# EAGLE design tssop14 (EAGLE 9.2.2)
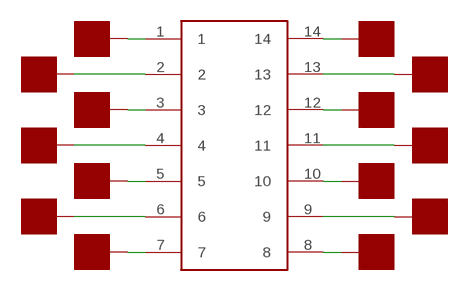
[diagram p0: schematic, sheet 1]

## Parts
IC1  TSSOP14  [TSSOP14]
U$1  PAD50MIL  [PAD_50MIL]
U$2  PAD50MIL  [PAD_50MIL]
U$3  PAD50MIL  [PAD_50MIL]
U$4  PAD50MIL  [PAD_50MIL]
U$5  PAD50MIL  [PAD_50MIL]
U$6  PAD50MIL  [PAD_50MIL]
U$7  PAD50MIL  [PAD_50MIL]
U$8  PAD50MIL  [PAD_50MIL]
U$9  PAD50MIL  [PAD_50MIL]
U$10  PAD50MIL  [PAD_50MIL]
U$11  PAD50MIL  [PAD_50MIL]
U$12  PAD50MIL  [PAD_50MIL]
U$13  PAD50MIL  [PAD_50MIL]
U$14  PAD50MIL  [PAD_50MIL]

## Nets
N$1: IC1.1 U$8.P$1
N$2: IC1.2 U$9.P$1
N$3: IC1.3 U$10.P$1
N$4: IC1.4 U$11.P$1
N$5: IC1.5 U$12.P$1
N$6: IC1.6 U$13.P$1
N$7: IC1.7 U$14.P$1
N$8: IC1.8 U$7.P$1
N$9: IC1.9 U$6.P$1
N$10: IC1.10 U$5.P$1
N$11: IC1.11 U$4.P$1
N$12: IC1.12 U$3.P$1
N$13: IC1.13 U$2.P$1
N$14: IC1.14 U$1.P$1

## Library data of the parts
IC1 = yapo:TSSOP14
U$1-U$14 = yapo:PAD

## Board
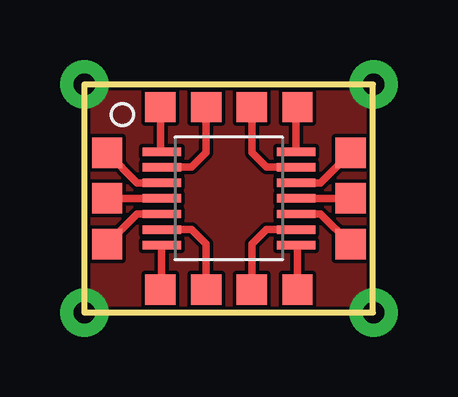
[diagram p1: board, top side]
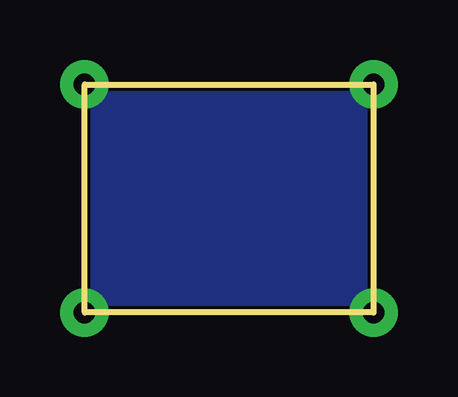
[diagram p2: board, bottom side, seen from below]

Size 12.04 x 9.51 mm. Coordinates in mm from the lower left corner, seen from the top.
Outline: 0,0 12.04,0 12.04,9.51 0,9.51 0,0
Copper layers (1*16): Top 0.035559375mm / dielectric 1.6mm / Bottom 0.035559375mm
Design rules "oshpark-2layer *": minimum track width 6mil, minimum drill 10mil, track to track 6mil, track to pad 6mil, pad to pad 6mil, via to via 6mil, smd to smd 6mil, copper to edge 5mil, drill to drill 6mil, minimum pad ring 5mil, minimum via ring 5mil, stop-mask expansion 2.5mil, vias tented up to drill 0mil, thermal gap 10mil

### Footprints (pad centres in the part's own frame; a part is rotated, then mirrored left to right if it is on the bottom)
TSSOP14 = smd 0.35 x 1.6: 1 -1.95,-2.8; 2 -1.3,-2.8; 3 -0.65,-2.8; 4 0,-2.8; 5 0.65,-2.8; 6 1.3,-2.8; 7 1.95,-2.8; 8 1.95,2.8; 9 1.3,2.8; 10 0.65,2.8; 11 0,2.8; 12 -0.65,2.8; 13 -1.3,2.8; 14 -1.95,2.8
PAD_50MIL = smd 1.27 x 1.27: P$1 0,0

### Placement (x,y rotation side)
IC1  6.03,4.76 90 top
U$1  3.17,0.95 0 top
U$2  5.08,0.95 0 top
U$3  0.95,2.86 0 top
U$4  0.95,4.76 0 top
U$5  0.95,6.67 0 top
U$6  5.08,8.57 0 top
U$7  3.17,8.57 0 top
U$8  8.89,0.95 0 top
U$9  6.99,0.95 0 top
U$10  11.11,2.86 0 top
U$11  11.11,4.76 0 top
U$12  11.11,6.67 0 top
U$13  6.99,8.57 0 top
U$14  8.89,8.57 0 top

### Tracks (layer width: path | path; a pad name or v marks a point on that pad's centre or on a via)
GND  (via drill 0.89 pad 2.03)  (3 unrouted)
  other vias: 0,9.53 12.06,9.53 12.06,0 0,0
  pour Bottom (no thermals): 0,9.53 12.06,9.53 12.06,0 0,0
  pour Top (no thermals): 0,9.53 12.06,9.53 12.06,0 0,0
N$1
  Top 0.305: IC1.1 8.89,2.75 U$8.P$1
N$2
  Top 0.305: IC1.2 7.59,3.46 6.99,2.86 U$9.P$1
N$3
  Top 0.305: IC1.3 9.86,4.11 U$10.P$1
N$4
  Top 0.305: IC1.4 U$11.P$1
N$5
  Top 0.305: IC1.5 9.86,5.41 U$12.P$1
N$6
  Top 0.305: IC1.6 7.59,6.06 6.99,6.67 U$13.P$1
N$7
  Top 0.305: IC1.7 8.83,8.52 U$14.P$1
N$8
  Top 0.305: IC1.8 3.17,6.77 U$7.P$1
N$9
  Top 0.305: IC1.9 4.47,6.06 5.08,6.67 U$6.P$1
N$10
  Top 0.305: IC1.10 2.21,5.41 U$5.P$1
N$11
  Top 0.305: IC1.11 U$4.P$1
N$12
  Top 0.305: IC1.12 2.21,4.11 U$3.P$1
N$13
  Top 0.305: IC1.13 4.47,3.46 5.08,2.86 U$2.P$1
N$14
  Top 0.305: IC1.14 3.23,1.01 U$1.P$1